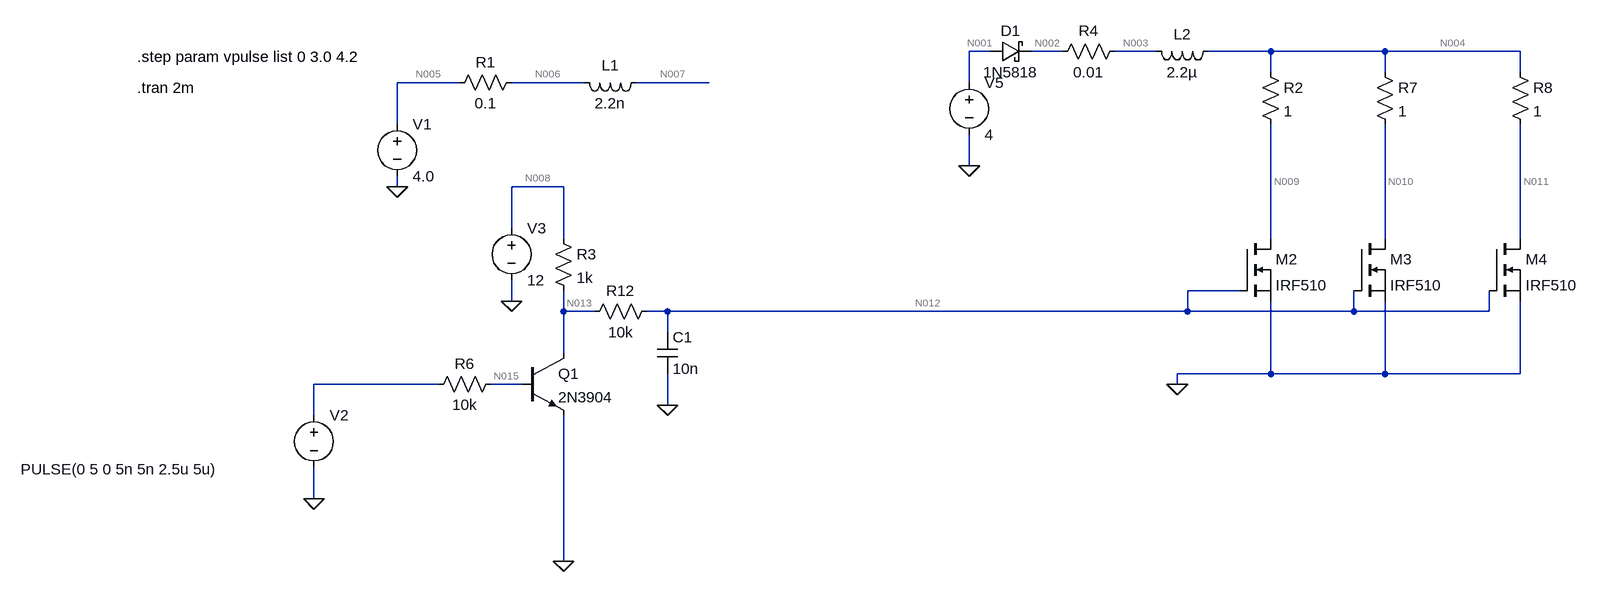
[diagram p0: schematic PowerReg.asc]
PowerReg.asc, the LTspice schematic file:
Version 4
SHEET 1 3992 884
WIRE 1008 -32 976 -32
WIRE 1120 -32 1072 -32
WIRE 1264 -32 1200 -32
WIRE 1440 -32 1344 -32
WIRE 1616 -32 1440 -32
WIRE 1824 -32 1616 -32
WIRE 1440 0 1440 -32
WIRE 1616 0 1616 -32
WIRE 1824 0 1824 -32
WIRE 192 16 96 16
WIRE 384 16 272 16
WIRE 576 16 464 16
WIRE 976 16 976 -32
WIRE 96 80 96 16
WIRE 976 144 976 96
WIRE 96 176 96 160
WIRE 352 176 272 176
WIRE 272 240 272 176
WIRE 352 256 352 176
WIRE 1440 256 1440 80
WIRE 1616 256 1616 80
WIRE 1824 256 1824 80
WIRE 1392 336 1312 336
WIRE 272 352 272 320
WIRE 352 368 352 336
WIRE 400 368 352 368
WIRE 512 368 480 368
WIRE 1312 368 1312 336
WIRE 1312 368 512 368
WIRE 1568 368 1568 336
WIRE 1568 368 1312 368
WIRE 1776 368 1776 336
WIRE 1776 368 1568 368
WIRE 512 400 512 368
WIRE 352 432 352 368
WIRE 1440 464 1440 352
WIRE 1440 464 1296 464
WIRE 1616 464 1616 352
WIRE 1616 464 1440 464
WIRE 1824 464 1824 352
WIRE 1824 464 1616 464
WIRE 160 480 -32 480
WIRE 288 480 240 480
WIRE 1296 480 1296 464
WIRE 512 512 512 464
WIRE -32 528 -32 480
WIRE -32 656 -32 608
WIRE 352 752 352 528
FLAG 96 176 0
FLAG -32 656 0
FLAG 272 352 0
FLAG 352 752 0
FLAG 1296 480 0
FLAG 976 144 0
FLAG 512 512 0
SYMBOL voltage -32 512 R0
WINDOW 3 -451 99 Left 2
WINDOW 123 0 0 Left 0
WINDOW 39 0 0 Left 0
SYMATTR Value PULSE(0 5 0 5n 5n 2.5u 5u)
SYMATTR InstName V2
SYMBOL res 176 32 R270
WINDOW 0 32 56 VTop 2
WINDOW 3 0 56 VBottom 2
SYMATTR InstName R1
SYMATTR Value 0.1
SYMBOL ind 480 0 R90
WINDOW 0 5 56 VBottom 2
WINDOW 3 32 56 VTop 2
SYMATTR InstName L1
SYMATTR Value 2.2n
SYMATTR SpiceLine Ipk=5 Rser=0.04 Rpar=3610.62 Cpar=0
SYMBOL voltage 96 64 R0
WINDOW 123 0 0 Left 0
WINDOW 39 0 0 Left 0
SYMATTR InstName V1
SYMATTR Value 4.0
SYMBOL res 256 464 R90
WINDOW 0 0 56 VBottom 2
WINDOW 3 32 56 VTop 2
SYMATTR InstName R6
SYMATTR Value 10k
SYMBOL voltage 272 224 R0
WINDOW 123 0 0 Left 0
WINDOW 39 0 0 Left 0
SYMATTR InstName V3
SYMATTR Value 12
SYMBOL npn 288 432 R0
SYMATTR InstName Q1
SYMATTR Value 2N3904
SYMBOL nmos 1392 256 R0
SYMATTR InstName M2
SYMATTR Value IRF510
SYMBOL voltage 976 0 R0
WINDOW 123 0 0 Left 0
WINDOW 39 0 0 Left 0
SYMATTR InstName V5
SYMATTR Value 4
SYMBOL res 1104 -16 R270
WINDOW 0 32 56 VTop 2
WINDOW 3 0 56 VBottom 2
SYMATTR InstName R4
SYMATTR Value 0.01
SYMBOL res 336 240 R0
SYMATTR InstName R3
SYMATTR Value 1k
SYMBOL nmos 1568 256 R0
SYMATTR InstName M3
SYMATTR Value IRF510
SYMBOL nmos 1776 256 R0
SYMATTR InstName M4
SYMATTR Value IRF510
SYMBOL schottky 1008 -16 R270
WINDOW 0 32 32 VTop 2
WINDOW 3 0 32 VBottom 2
SYMATTR InstName D1
SYMATTR Value 1N5818
SYMATTR Description Diode
SYMATTR Type diode
SYMBOL res 496 352 R90
WINDOW 0 0 56 VBottom 2
WINDOW 3 32 56 VTop 2
SYMATTR InstName R12
SYMATTR Value 10k
SYMBOL cap 496 400 R0
SYMATTR InstName C1
SYMATTR Value 10n
SYMBOL ind 1360 -48 R90
WINDOW 0 5 56 VBottom 2
WINDOW 3 32 56 VTop 2
SYMATTR InstName L2
SYMATTR Value 2.2µ
SYMBOL res 1424 -16 R0
SYMATTR InstName R2
SYMATTR Value 1
SYMBOL res 1600 -16 R0
SYMATTR InstName R7
SYMATTR Value 1
SYMBOL res 1808 -16 R0
SYMATTR InstName R8
SYMATTR Value 1
TEXT -304 -24 Left 2 !.step param vpulse list 0 3.0 4.2
TEXT -304 24 Left 2 !.tran 2m

The netlist it stands for:
* PowerReg.asc
V2 N014 0 PULSE(0 5 0 5n 5n 2.5u 5u)
R1 N005 N006 0.1
L1 N007 N006 2.2n Ipk=5 Rser=0.04 Rpar=3610.62 Cpar=0
V1 N005 0 4.0
R6 N015 N014 10k
V3 N008 0 12
Q1 N013 N015 0 0 2N3904
M2 N009 N012 0 0 IRF510
V5 N001 0 4
R4 N002 N003 0.01
R3 N008 N013 1k
M3 N010 N012 0 0 IRF510
M4 N011 N012 0 0 IRF510
D1 N001 N002 1N5818
R12 N012 N013 10k
C1 N012 0 10n
L2 N004 N003 2.2µ
R2 N004 N009 1
R7 N004 N010 1
R8 N004 N011 1
.model D D
.lib standard.dio
.model NPN NPN
.model PNP PNP
.lib standard.bjt
.model NMOS NMOS
.model PMOS PMOS
.lib standard.mos
.step param vpulse list 0 3.0 4.2
.tran 2m
.backanno
.end

* Results of the author's LTspice run, read from the files saved beside the schematic
* Operating Point (first step), zero values left out:
*   V(n005) = 4 V
*   V(n006) = 4 V
*   V(n007) = 4 V
*   V(n015) = 120 nV
*   V(n008) = 12 V
*   V(n013) = 12 V
*   V(n009) = 812.6 mV
*   V(n012) = 12 V
*   V(n001) = 4 V
*   V(n002) = 3.208 V
*   V(n003) = 3.139 V
*   V(n010) = 812.6 mV
*   V(n011) = 812.6 mV
*   V(n004) = 3.132 V
*   Ic(Q1) = 12.03 pA
*   Ib(Q1) = -12 pA
*   Id(M4) = 2.319 A
*   Is(M4) = -2.319 A
*   Id(M3) = 2.319 A
*   Is(M3) = -2.319 A
*   Id(M2) = 2.319 A
*   Is(M2) = -2.319 A
*   I(D1) = 6.958 A
*   I(L2) = -6.958 A
*   I(R8) = 2.319 A
*   I(R7) = 2.319 A
*   I(R2) = 2.319 A
*   I(R3) = 12.01 pA
*   I(R4) = 6.958 A
*   I(R6) = 12 pA
*   I(V5) = -6.958 A
*   I(V3) = -12.01 pA
*   I(V2) = 12 pA